# Altium schematic sheet GSM_Unit.SchDoc
size A4
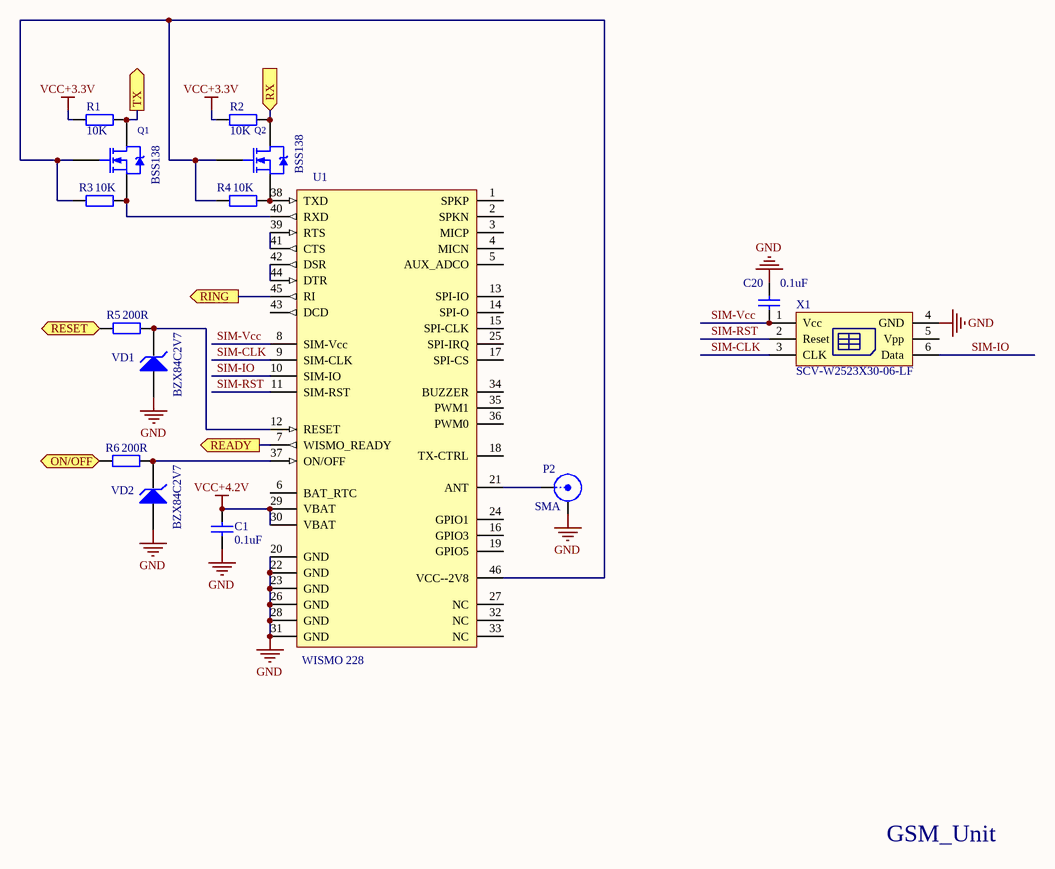
[diagram p0: GSM_Unit.SchDoc]

## Parts
C1  value 0.1uF  [C0603]  (hidden comment: CAP_SMD)
C20  value 0.1uF  [C0603]  (hidden comment: CAP_SMD)
P2  SMA  [SMA]
Q1  BSS138  [SOT23]
Q2  BSS138  [SOT23]
R1  value 10K  [C0603]  (hidden comment: RES_SMD)
R2  value 10K  [C0603]  (hidden comment: RES_SMD)
R3  value 10K  [C0603]  (hidden comment: RES_SMD)
R4  value 10K  [C0603]  (hidden comment: RES_SMD)
R5  value 200R  [C0603]  (hidden comment: RES_SMD)
R6  value 200R  [C0603]  (hidden comment: RES_SMD)
U1  WISMO 228  [WISMO]
VD1  BZX84C2V7  [SOT23]
VD2  BZX84C2V7  [SOT23]
X1  SCV-W2523X30-06-LF  [SCV-W2523X30-06-LF]

## Ports
ON/OFF (in), READY (out), RESET (in), RING (out), RX (in), TX (out)

## Nets
GND: C1.2 C20.1 P2.2(Y) U1.20(GND) U1.22(GND) U1.23(GND) U1.26(GND) U1.28(GND) U1.31(GND) VD1.1(A) VD2.1(A) X1.4(GND)
VCC+3.3V: R1.1 R2.1
VCC+4.2V: C1.1 U1.29(VBAT) U1.30(VBAT)
ON/OFF: R6.1 ; port ON/OFF
READY: U1.7(WISMO_READY) ; port READY
RESET: R5.1 ; port RESET
RING: U1.45(RI) ; port RING
RX: Q2.3(D) R2.2 ; port RX
SIM-CLK: U1.9(SIM-CLK) X1.3(CLK)
SIM-IO: U1.10(SIM-IO) X1.6(Data)
SIM-RST: U1.11(SIM-RST) X1.2(Reset)
SIM-Vcc: C20.2 U1.8(SIM-Vcc) X1.1(Vcc)
TX: Q1.3(D) R1.2 ; port TX
NetP2_1: P2.1(X) U1.21(ANT)
NetQ1_1: Q1.1(G) Q2.1(G) R3.1 R4.1 U1.46(VCC--2V8)
NetQ1_2: Q1.2(S) R3.2 U1.40(RXD)
NetQ2_2: Q2.2(S) R4.2 U1.38(TXD)
NetR5_2: R5.2 U1.12(RESET) VD1.3(K)
NetR6_2: R6.2 U1.37(ON/OFF) VD2.3(K)
NetU1_39: U1.39(RTS) U1.41(CTS)
NetU1_42: U1.42(DSR) U1.44(DTR)

Not connected (* = marked no-connect by the designer): U1 1(SPKP) 2(SPKN) 3(MICP) 4(MICN) 5(AUX_ADCO) 6(BAT_RTC) 13(SPI-IO) 14(SPI-O) 15(SPI-CLK) 16(GPIO3) 17(SPI-CS) 18(TX-CTRL) 19(GPIO5) 24(GPIO1) 25(SPI-IRQ) 27(NC) 32(NC) 33(NC) 34(BUZZER) 35(PWM1) 36(PWM0) 43(DCD); VD1 2; VD2 2; X1 5(Vpp)

## Notes on the sheet
- GSM_Unit

## Library data of the parts
C1 C20 = Capasitor_SMD_0805: Capasitor_SMD_0808/
Q1 Q2 = BSS138-SOT23
R1-R6 = RES: Resistor
VD1 VD2 = BZX84C: Value: *
X1 = SCV-W2523X30-06-LF: SIM Cartreader
P2 = SMA: LatestRevisionDate: 17-Jul-2002; Publisher: Altium Limited; LatestRevisionNote: Re-released for DXP Platform.; Value: *